# Altium schematic sheet Power.SchDoc
size A3; SheetNumber: 3; SheetTotal: 5
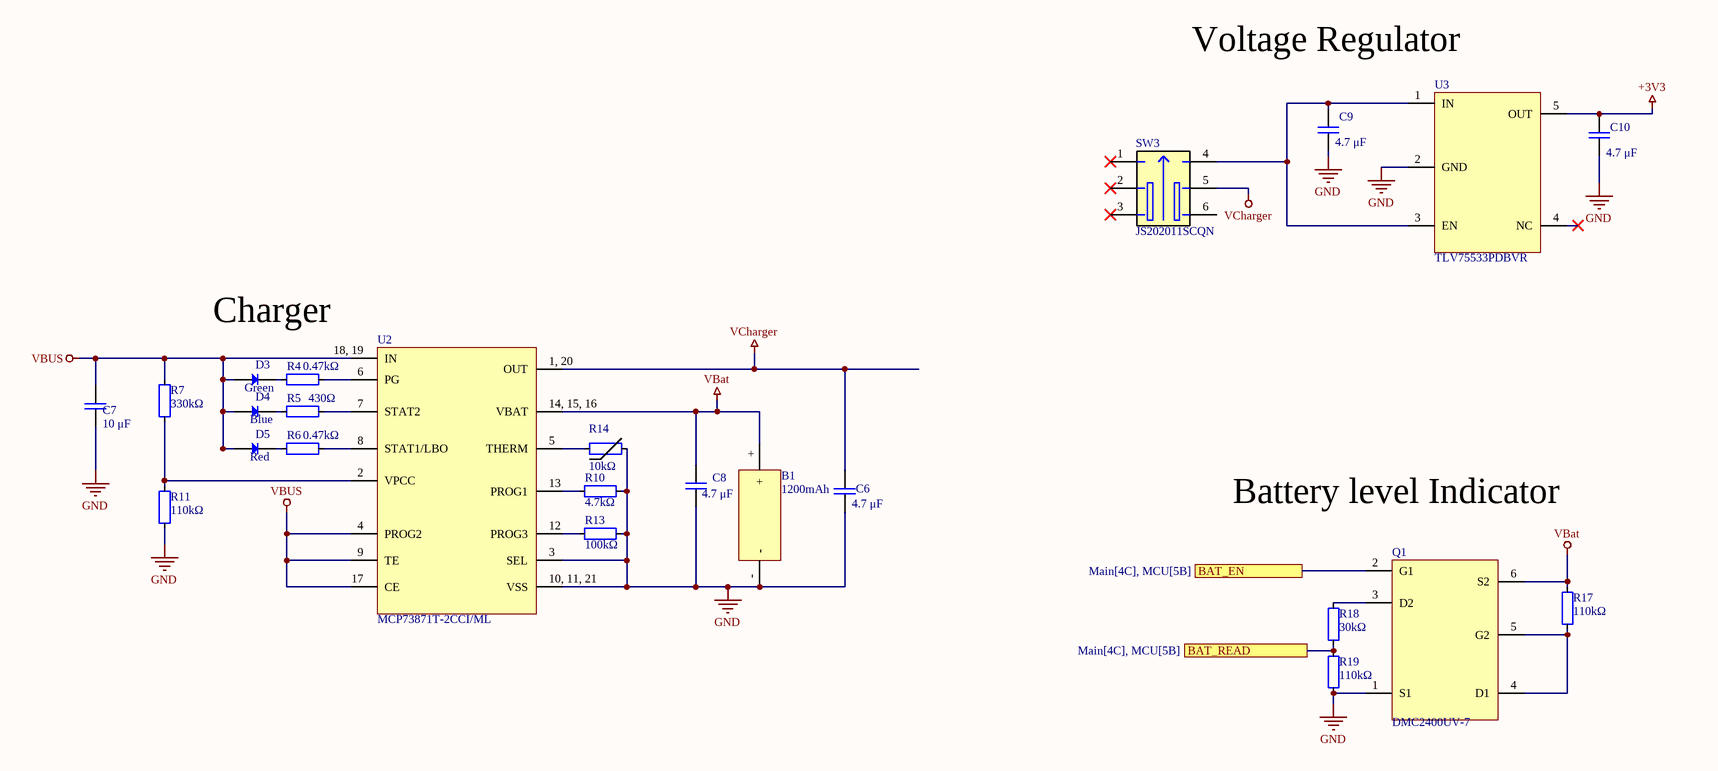
[diagram p0: Power.SchDoc]

## Parts
B1  1200mAh  [battery]
C6  4.7 μF  [Capacitor 0603]
C7  10 μF  [Capacitor 0603]
C8  4.7 μF  [Capacitor 0603]
C9  4.7 μF  [Capacitor 0603]
C10  4.7 μF  [Capacitor 0603]
D3  Green  [LED 0603]
D4  Blue  [LED 0603]
D5  Red  [LED 0603]
Q1  DMC2400UV-7  [MOSFET N/P-CH]
R4  0.47kΩ  [Resistor 0603]
R5  430Ω  [Resistor 0603]
R6  0.47kΩ  [Resistor 0603]
R7  330kΩ  [Resistor 0603]
R10  4.7kΩ  [Resistor 0603]
R11  110kΩ  [Resistor 0603]
R13  100kΩ  [Resistor 0603]
R14  10kΩ  [Thermistor 0603]
R17  110kΩ  [Resistor 0603]
R18  30kΩ  [Resistor 0603]
R19  110kΩ  [Resistor 0603]
SW3  JS202011SCQN  [JS202011SCQN]
U2  MCP73871T-2CCI/ML  [MCP73871]
U3  TLV75533PDBVR  [TLV75533PDBVR]

## Ports
BAT_EN (see Main[4C], MCU[5B]), BAT_READ (see Main[4C], MCU[5B])

## Nets
+3V3: C10.A U3.5(OUT)
GND: B1.- C6.A C7.A C8.B C9.A C10.B Q1.1(S1) R10.B R11.A R13.B R14.B R19.A U2.3(SEL) U2.10,_11,_21(VSS) U3.2(GND)
VBat: B1.+ C8.A Q1.6(S2) R17.A U2.14,_15,_16(VBAT)
VBUS: C7.B D3.A D4.A D5.A R7.B U2.4(PROG2) U2.9(TE) U2.17(CE) U2.18,_19(IN)
VCharger: C6.B SW3.5 U2.1,_20(OUT)
BAT_EN: Q1.2(G1) ; port BAT_EN
BAT_READ: R18.A R19.B ; port BAT_READ
NetC9_B: C9.B SW3.4 U3.1(IN) U3.3(EN)
NetD3_B: D3.B R4.A
NetD4_B: D4.B R5.A
NetD5_B: D5.B R6.A
NetQ1_3: Q1.3(D2) R18.B
NetQ1_4: Q1.4(D1) Q1.5(G2) R17.B
NetR4_B: R4.B U2.6(PG)
NetR5_B: R5.B U2.7(STAT2)
NetR6_B: R6.B U2.8(STAT1/LBO)
NetR7_A: R7.A R11.B U2.2(VPCC)
NetR10_A: R10.A U2.13(PROG1)
NetR13_A: R13.A U2.12(PROG3)
NetR14_A: R14.A U2.5(THERM)

Not connected (* = marked no-connect by the designer): SW3 1* 2* 3* 6; U3 4(NC)*

## Notes on the sheet
- Voltage Regulator
- Charger
- Battery level Indicator

## Library data of the parts
B1 = Battery: Lipobatteri - 103040 - 1.200 mAh; Manufacturer: batterikungen; Manufacturer Part Number: 103040; Supplier 1: Batterikungen; Supplier Part Number 1: 827-016; Value: 1200mAh
C6 C8-C10 = 4,7 μF 0603: Capacitor 4.7 μF; Manufacturer: Samsung Electro-Mechanics; Manufacturer Part Number: CL10A475KP8NNNC; Supplier 1: Digikey; Supplier Part Number 1: 1276-1044-1-ND; Value: 4.7 μF
C7 = 10 μF 0603: Capacitor 10 μF; Manufacturer: Samsung Electro-Mechanics; Manufacturer Part Number: CL10A106MQ8NNNC; Supplier 1: Digikey; Supplier Part Number 1: 1276-1119-1-ND; Value: 10 μF
D3 = D.Green: Diode Green; Manufacturer: Lumex Opto/Components Inc.; Manufacturer Part Number: SML-LXFT0603GC-TR; Supplier 1: Digikey; Supplier Part Number 1: 67-SML-LXFT0603GC-TRCT-ND; Value: Green
D4 = D.Blue: Diode Blue; Manufacturer: Lite-On Inc.; Manufacturer Part Number: LTST-C193TBKT-5A; Supplier 1: Digikey; Supplier Part Number 1: 160-1827-1-ND; Value: Blue
D5 = D.Red: Diode Red; Manufacturer: Lite-On Inc.; Manufacturer Part Number: LTST-C190KRKT; Supplier 1: Digikey; Supplier Part Number 1: 160-1436-1-ND; Value: Red
Q1 = DMC2400UV-7: MOSFET N/P-CH 20V SOT563; Manufacturer: Diodes Incorporated; Supplier 1: Digikey; Supplier Part Number 1: DMC2400UV-7DICT-ND; Manufacturer Part Number: DMC2400UV-7
R4 R6 = 0.47 kΩ 0603: Resistor 470 Ω; Manufacturer: Stackpole Electronics Inc; Manufacturer Part Number: RMCF0603FT470R; Supplier 1: Digikey; Supplier Part Number 1: RMCF0603FT470RCT-ND; Value: 0.47kΩ
R5 = 430 Ω 0603: Resistor 430 Ω; Manufacturer: Stackpole Electronics Inc; Manufacturer Part Number: RMCF0603JT430R; Supplier 1: Digikey; Supplier Part Number 1: RMCF0603JT430RCT-ND; Value: 430Ω
R7 = 330 kΩ 0603: Resistor 330000 Ω; Manufacturer: YAGEO; Manufacturer Part Number: RC0603JR-07330KL; Supplier 1: Digikey; Supplier Part Number 1: 311-330KGRCT-ND; Value: 330kΩ
R10 = 4.7 kΩ 0603: Resistor 4700 Ω; Manufacturer: Stackpole Electronics Inc; Manufacturer Part Number: RMCF0603FT4K70; Supplier 1: Digikey; Supplier Part Number 1: RMCF0603FT4K70CT-ND; Value: 4.7kΩ
R11 R17 R19 = 110 kΩ 0603: Resistor 110000 Ω; Manufacturer: Stackpole Electronics Inc; Manufacturer Part Number: RMCF0603FT110K; Supplier 1: Digikey; Supplier Part Number 1: RMCF0603FT110KCT-ND; Value: 110kΩ
R13 = 100 kΩ 0603: Resistor 100000 Ω; Manufacturer: Stackpole Electronics Inc; Manufacturer Part Number: RMCF0603FT100K; Supplier 1: Digikey; Supplier Part Number 1: RMCF0603FT100KCT-ND; Value: 100kΩ
R14 = NTC 10 KΩ 0603: Thermistor 10000 Ω; Manufacturer: Panasonic Electronic Components; Manufacturer Part Number: ERT-J1VR103J; Supplier 1: Digikey; Supplier Part Number 1: P10547CT-ND; Value: 10kΩ
R18 = 30 kΩ 0603: Resistor 30000 Ω; Manufacturer: YAGEO; Manufacturer Part Number: RC0603FR-0730KL; Supplier 1: Digikey; Supplier Part Number 1: 311-30.0KHRCT-ND; Value: 30kΩ
SW3 = JS202011SCQN: SWITCH SLIDE DPDT 300MA 6V; Manufacturer: C&K; Supplier 1: Digikey; Supplier Part Number 1: 401-2002-1-ND; Manufacturer Part Number: JS202011SCQN
U2 = MCP73871: IC BATT CHG LI-ION 1CELL 20QFN; Manufacturer: Microchip Technology; Supplier 1: Digikey; Supplier Part Number 1: MCP73871T-2CCI/MLDKR-ND; Manufacturer Part Number: MCP73871T-2CCI/ML
U3 = TLV75533PDBVR: IC REG LINEAR 3.3V 500MA SOT23-5; Manufacturer: Texas Instruments; Supplier 1: Digikey; Supplier Part Number 1: 296-50411-1-ND; Manufacturer Part Number: TLV75533PDBVR